# Altium schematic sheet DB-LED_V1.0.SchDoc
size A4
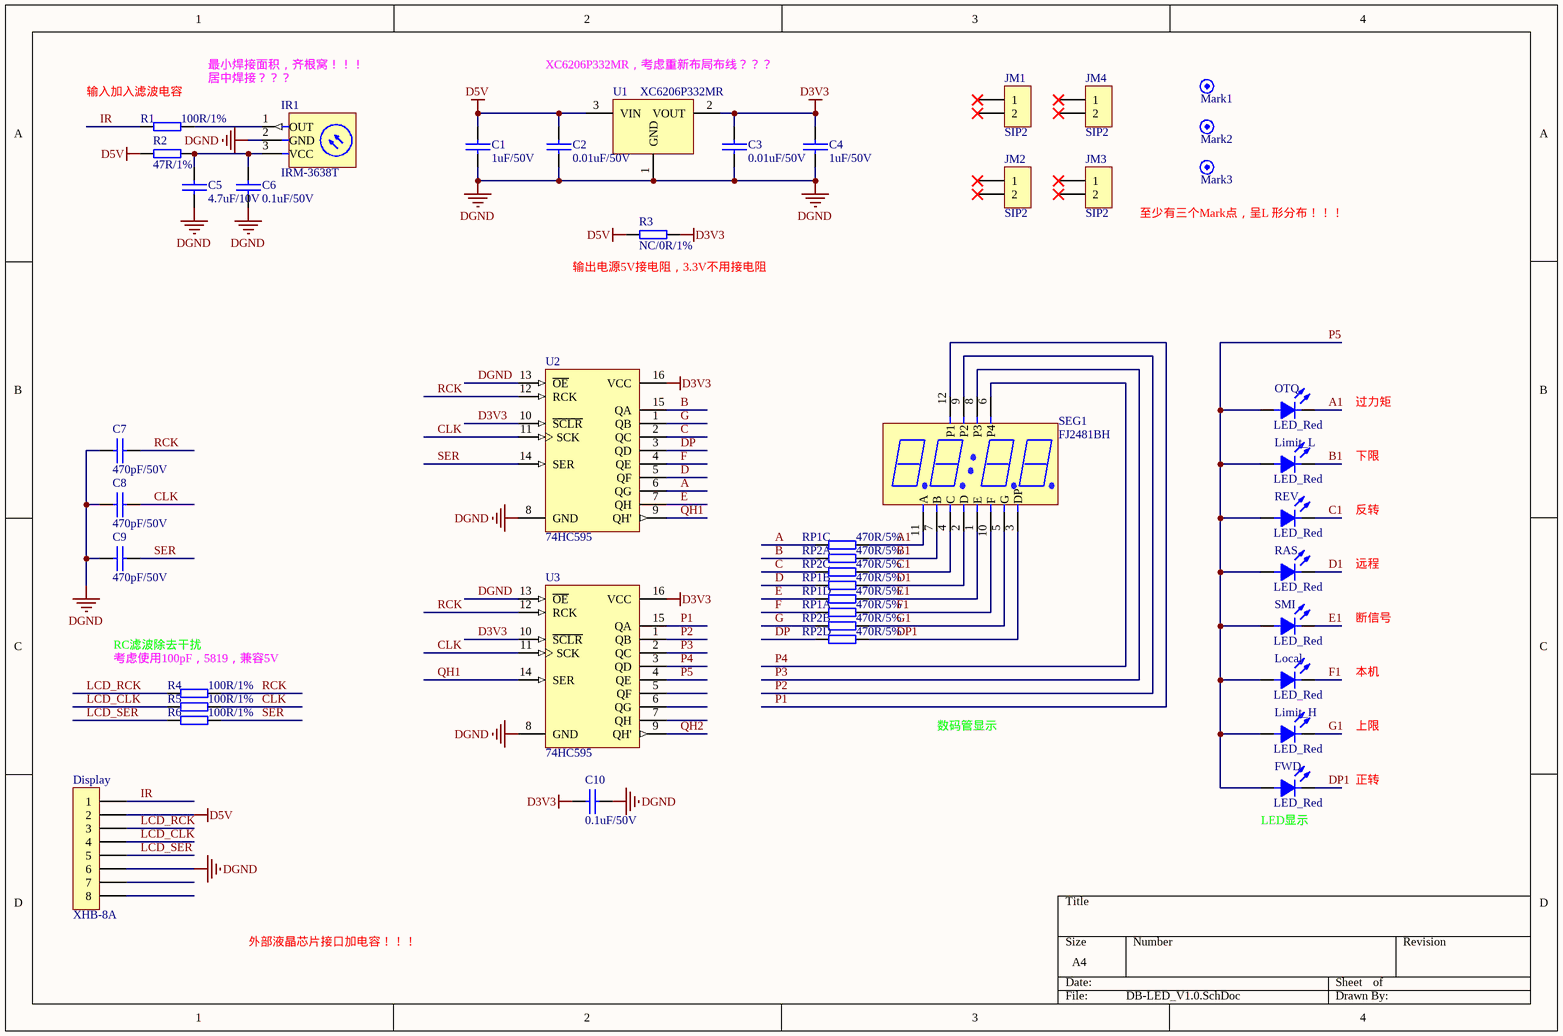
[diagram p0: DB-LED_V1.0.SchDoc]

## Parts
C1  1uF/50V  [0603(C)]
C2  0.01uF/50V  [0603(C)]
C3  0.01uF/50V  [0603(C)]
C4  1uF/50V  [0603(C)]
C5  4.7uF/10V  [0603(C)]
C6  0.1uF/50V  [0603(C)]
C7  470pF/50V  [0603(C)]
C8  470pF/50V  [0603(C)]
C9  470pF/50V  [0603(C)]
C10  0.1uF/50V  [0603(C)]
Display  XHB-8A  [XHB2.5-8A]
FWD  LED_Red  [LED2-TM[.1]/3]
IR1  IRM-3638T  [IR3-RM6/7]
JM1  SIP2  [SIP2-TM[.1]]
JM2  SIP2  [SIP2-TM[.1]]
JM3  SIP2  [SIP2-TM[.1]]
JM4  SIP2  [SIP2-TM[.1]]
Limit_H  LED_Red  [LED2-TM[.1]/3]
Limit_L  LED_Red  [LED2-TM[.1]/3]
Local  LED_Red  [LED2-TM[.1]/3]
Mark1  Mark  [MARK-3MM[SINGlE]]  (value not drawn)  (no BOM)
Mark2  Mark  [MARK-3MM[SINGlE]]  (value not drawn)  (no BOM)
Mark3  Mark  [MARK-3MM[SINGlE]]  (value not drawn)  (no BOM)
OTQ  LED_Red  [LED2-TM[.1]/3]
R1  100R/1%  [0603(R)]
R2  47R/1%  [0603(R)]
R3  NC/0R/1%  [0603(R)]
R4  100R/1%  [0603(R)]
R5  100R/1%  [0603(R)]
R6  100R/1%  [0603(R)]
RAS  LED_Red  [LED2-TM[.1]/3]
REV  LED_Red  [LED2-TM[.1]/3]
RP1  470R/5%  [4D03(S)]  (parts A,B,C,D of 4)
RP2  470R/5%  [4D03(S)]  (parts A,B,C,D of 4)
SEG1  FJ2481BH  [SEG4-TM[.3]/[.5]]
SMI  LED_Red  [LED2-TM[.1]/3]
U1  XC6206P332MR  [SOT23-3-W]
U2  74HC595  [SO16-[.15](S)]
U3  74HC595  [SO16-[.15](S)]

## Nets
D3V3: C3.1 C4.1 C10.1 R3.1 U1.2(VOUT) U2.10(~{SCLR}) U2.16(VCC) U3.10(~{SCLR}) U3.16(VCC)
D5V: C1.1 C2.1 Display.2 R2.1 R3.2 U1.3(VIN)
DGND: C1.2 C2.2 C3.2 C4.2 C5.2 C6.2 C7.2 C8.2 C9.2 C10.2 Display.6 IR1.2(GND) U1.1(GND) U2.8(GND) U2.13(~{OE}) U3.8(GND) U3.13(~{OE})
A: RP1.6 U2.6(QG)
A1: OTQ.2(K) RP1.3 SEG1.11(A)
B: RP2.8 U2.15(QA)
B1: Limit_L.2(K) RP2.1 SEG1.7(B)
C: RP2.6 U2.2(QC)
C1: REV.2(K) RP2.3 SEG1.4(C)
CLK: C8.1 R5.1 U2.11(SCK) U3.11(SCK)
D: RP1.7 U2.5(QF)
D1: RAS.2(K) RP1.2 SEG1.2(D)
DP: RP2.5 U2.3(QD)
DP1: FWD.2(K) RP2.4 SEG1.3(DP)
E: RP1.5 U2.7(QH)
E1: RP1.4 SEG1.1(E) SMI.2(K)
F: RP1.8 U2.4(QE)
F1: Local.2(K) RP1.1 SEG1.10(F)
G: RP2.7 U2.1(QB)
G1: Limit_H.2(K) RP2.2 SEG1.5(G)
IR: Display.1 R1.1
LCD_CLK: Display.4 R5.2
LCD_RCK: Display.3 R4.2
LCD_SER: Display.5 R6.2
P1: SEG1.12(P1) U3.15(QA)
P2: SEG1.9(P2) U3.1(QB)
P3: SEG1.8(P3) U3.2(QC)
P4: SEG1.6(P4) U3.3(QD)
P5: FWD.1(A) Limit_H.1(A) Limit_L.1(A) Local.1(A) OTQ.1(A) RAS.1(A) REV.1(A) SMI.1(A) U3.4(QE)
QH1: U2.9(QH') U3.14(SER)
QH2: U3.9(QH')
RCK: C7.1 R4.1 U2.12(RCK) U3.12(RCK)
SER: C9.1 R6.1 U2.14(SER)
NetC5_1: C5.1 C6.1 IR1.3(VCC) R2.2
NetIR1_1: IR1.1(OUT) R1.2

Not connected (* = marked no-connect by the designer): Display 7 8; JM1 1* 2*; JM2 1* 2*; JM3 1* 2*; JM4 1* 2*; U3 5(QF) 6(QG) 7(QH)

## Notes on the sheet
- (near R1) 输入加入滤波电容
- 最小焊接面积，齐根窝！！！
- 居中焊接？？？
- (near U1) XC6206P332MR，考虑重新布局布线？？？
- 至少有三个Mark点，呈L 形分布！！！
- (near R3) 输出电源5V接电阻，3.3V不用接电阻
- 过力矩
- 下限
- 反转
- 远程
- RC滤波除去干扰
- 断信号
- 考虑使用100pF，5819，兼容5V
- 本机
- 数码管显示
- 上限
- 正转
- (near FWD) LED显示
- 外部液晶芯片接口加电容！！！

## Library data of the parts
C1 C4 C5 = Cap: /(X5R)/10%
C2 C3 C6-C10 = Cap: /(X7R)/10%
Display = CON8
FWD Limit_H Limit_L Local OTQ RAS REV SMI = LED
IR1 = HS38B
JM1-JM4 = CON2
R1-R6 = Res
RP1 RP2 = Res-8P4R
SEG1 = LG2841DH
U1 = XC6206PXXXMR